# Altium schematic sheet Goldfinger_Connector.SchDoc
size A4; CompanyName: Technische Hochschule Nürnberg Georg Simon Ohm; Organization: UltraZohm; Address1: Kesslerplatz 12; Address2: 90489 Nürnberg; Address3: GERMANY; DocumentNumber: 12; SheetNumber: 12; SheetTotal: 12; Website: www.ultrazohm.com
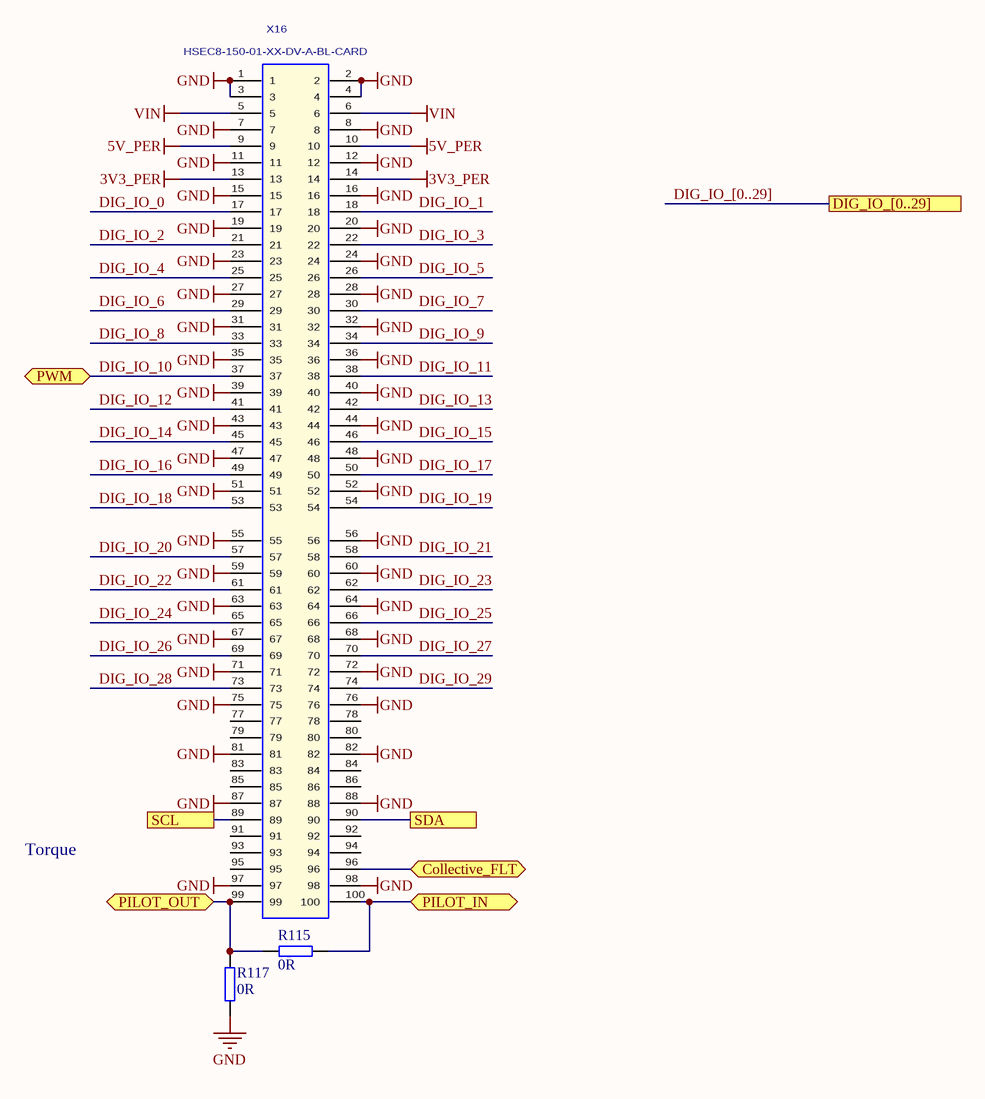
[diagram p0: Goldfinger_Connector.SchDoc]

## Parts
R115  0R  [RESC1608X06N]
R117  0R  [RESC1608X06N]
X16  HSEC8-150-01-XX-DV-A-BL-CARD  [HSEC8-150-01-XX-DV-A-BL-CARD]  (no BOM)

## Ports
Collective_FLT (bidir), DIG_IO_[0..29], PILOT_IN (bidir), PILOT_OUT (bidir), PWM (bidir), SCL, SDA

## Nets
3V3_PER: X16.13 X16.14
5V_PER: X16.9 X16.10
GND: R117.1 X16.1 X16.2 X16.3 X16.4 X16.7 X16.8 X16.11 X16.12 X16.15 X16.16 X16.19 X16.20 X16.23 X16.24 X16.27 X16.28 X16.31 X16.32 X16.35 X16.36 X16.39 X16.40 X16.43 X16.44 X16.47 X16.48 X16.51 X16.52 X16.55 X16.56 X16.59 X16.60 X16.63 X16.64 X16.67 X16.68 X16.71 X16.72 X16.75 X16.76 X16.81 X16.82 X16.87 X16.88 X16.97 X16.98
VIN: X16.5 X16.6
Collective_FLT: X16.96 ; port Collective_FLT
DIG_IO_0: X16.17
DIG_IO_1: X16.18
DIG_IO_2: X16.21
DIG_IO_3: X16.22
DIG_IO_4: X16.25
DIG_IO_5: X16.26
DIG_IO_6: X16.29
DIG_IO_7: X16.30
DIG_IO_8: X16.33
DIG_IO_9: X16.34
DIG_IO_10: X16.37 ; port PWM
DIG_IO_11: X16.38
DIG_IO_12: X16.41
DIG_IO_13: X16.42
DIG_IO_14: X16.45
DIG_IO_15: X16.46
DIG_IO_16: X16.49
DIG_IO_17: X16.50
DIG_IO_18: X16.53
DIG_IO_19: X16.54
DIG_IO_20: X16.57
DIG_IO_21: X16.58
DIG_IO_22: X16.61
DIG_IO_23: X16.62
DIG_IO_24: X16.65
DIG_IO_25: X16.66
DIG_IO_26: X16.69
DIG_IO_27: X16.70
DIG_IO_28: X16.73
DIG_IO_29: X16.74
PILOT_IN: R115.2 X16.100 ; port PILOT_IN
PILOT_OUT: R115.1 R117.2 X16.99 ; port PILOT_OUT
SCL: X16.89 ; port SCL
SDA: X16.90 ; port SDA

Not connected (* = marked no-connect by the designer): X16 77 78 79 80 83 84 85 86 91 92 93 94 95

## Buses and harness runs
bus DIG_IO_[0..29] = port DIG_IO_[0..29]

## Notes on the sheet
- Torque
- Title
- Revision:
- Design Engineer:
- Date:
- Project:
- Sheet
- of

## Library data of the parts
R115 R117 = R_0603: MPN: CRCW06030000Z0EAC; MF: Vishay; Value: 0R; Supplier 1: Mouser; Supplier Part Number 1: 71-CRCW06030000Z0EAC
X16 = HSEC8-150-01-XX-DV-A-BL-CARD: Mating Card Layout for HSEC8-150-01-XX-DV-A-BL; Manufacturer: SAMTEC; Created: 2018_04_23_AGeiger; Value: HSEC8-150-01-XX-DV-A-BL-CARD